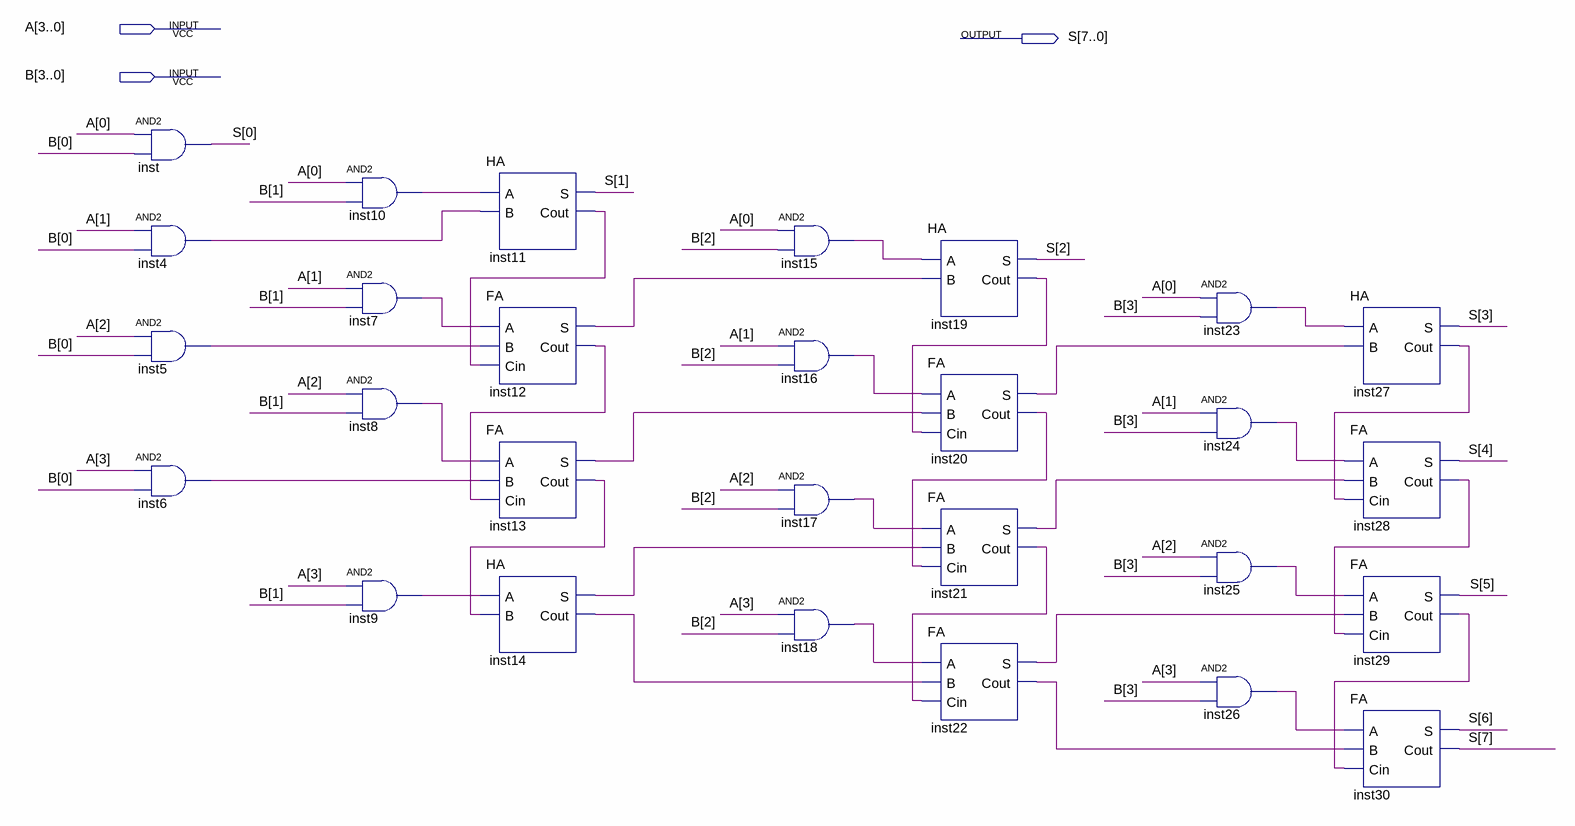
[diagram p0: schematic sheet]
// Quartus schematic Mult.bdf as structural Verilog: 28 symbols, 3 pins
module Mult (
  input  [3:0] A,
  input  [3:0] B,
  output [7:0] S
);

  wire inst4_out, inst5_out, inst6_out, inst7_out, inst8_out, inst9_out, inst10_out, inst11_cout,
       inst12_cout, inst12_s, inst13_cout, inst13_s, inst14_cout, inst14_s, inst15_out, inst16_out,
       inst17_out, inst18_out, inst19_cout, inst20_cout, inst20_s, inst21_cout, inst21_s, inst22_cout,
       inst22_s, inst23_out, inst24_out, inst25_out, inst26_out, inst27_cout, inst28_cout, inst29_cout;

  and inst (S[0], A[0], B[0]);
  and inst4 (inst4_out, A[1], B[0]);
  and inst5 (inst5_out, A[2], B[0]);
  and inst6 (inst6_out, A[3], B[0]);
  and inst10 (inst10_out, A[0], B[1]);
  and inst7 (inst7_out, A[1], B[1]);
  and inst8 (inst8_out, A[2], B[1]);
  and inst9 (inst9_out, A[3], B[1]);
  HA inst11 (.A(inst10_out), .B(inst4_out), .S(S[1]), .Cout(inst11_cout));
  FA inst12 (.A(inst7_out), .B(inst5_out), .Cin(inst11_cout), .S(inst12_s), .Cout(inst12_cout));
  FA inst13 (.A(inst8_out), .B(inst6_out), .Cin(inst12_cout), .S(inst13_s), .Cout(inst13_cout));
  HA inst14 (.A(inst9_out), .B(inst13_cout), .S(inst14_s), .Cout(inst14_cout));
  and inst15 (inst15_out, A[0], B[2]);
  and inst16 (inst16_out, A[1], B[2]);
  and inst17 (inst17_out, A[2], B[2]);
  and inst18 (inst18_out, A[3], B[2]);
  HA inst19 (.A(inst15_out), .B(inst12_s), .S(S[2]), .Cout(inst19_cout));
  FA inst20 (.A(inst16_out), .B(inst13_s), .Cin(inst19_cout), .S(inst20_s), .Cout(inst20_cout));
  FA inst21 (.A(inst17_out), .B(inst14_s), .Cin(inst20_cout), .S(inst21_s), .Cout(inst21_cout));
  FA inst22 (.A(inst18_out), .B(inst14_cout), .Cin(inst21_cout), .S(inst22_s), .Cout(inst22_cout));
  and inst23 (inst23_out, A[0], B[3]);
  and inst24 (inst24_out, A[1], B[3]);
  and inst25 (inst25_out, A[2], B[3]);
  and inst26 (inst26_out, A[3], B[3]);
  HA inst27 (.A(inst23_out), .B(inst20_s), .S(S[3]), .Cout(inst27_cout));
  FA inst28 (.A(inst24_out), .B(inst21_s), .Cin(inst27_cout), .S(S[4]), .Cout(inst28_cout));
  FA inst29 (.A(inst25_out), .B(inst22_s), .Cin(inst28_cout), .S(S[5]), .Cout(inst29_cout));
  FA inst30 (.A(inst26_out), .B(inst22_cout), .Cin(inst29_cout), .S(S[6]), .Cout(S[7]));
endmodule
